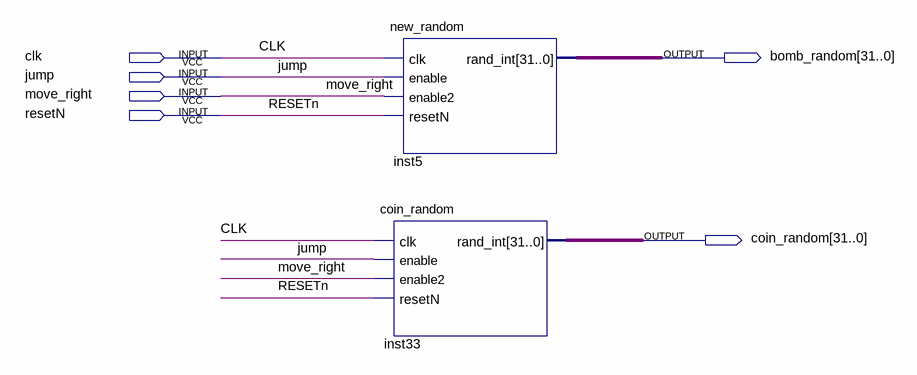
[diagram p0: schematic sheet]
// Quartus schematic random_modle.bdf as structural Verilog: 2 symbols, 6 pins
module random_modle (
  input  clk,
  input  jump,
  input  move_right,
  input  resetN,
  output [31:0] bomb_random,
  output [31:0] coin_random
);

  new_random inst5 (.clk(clk), .enable(jump), .enable2(move_right), .resetN(resetN), .rand_int(bomb_random));
  coin_random inst33 (.clk(clk), .enable(jump), .enable2(move_right), .resetN(resetN), .rand_int(coin_random));
endmodule
